# EAGLE design leduino (EAGLE 7.1.0)
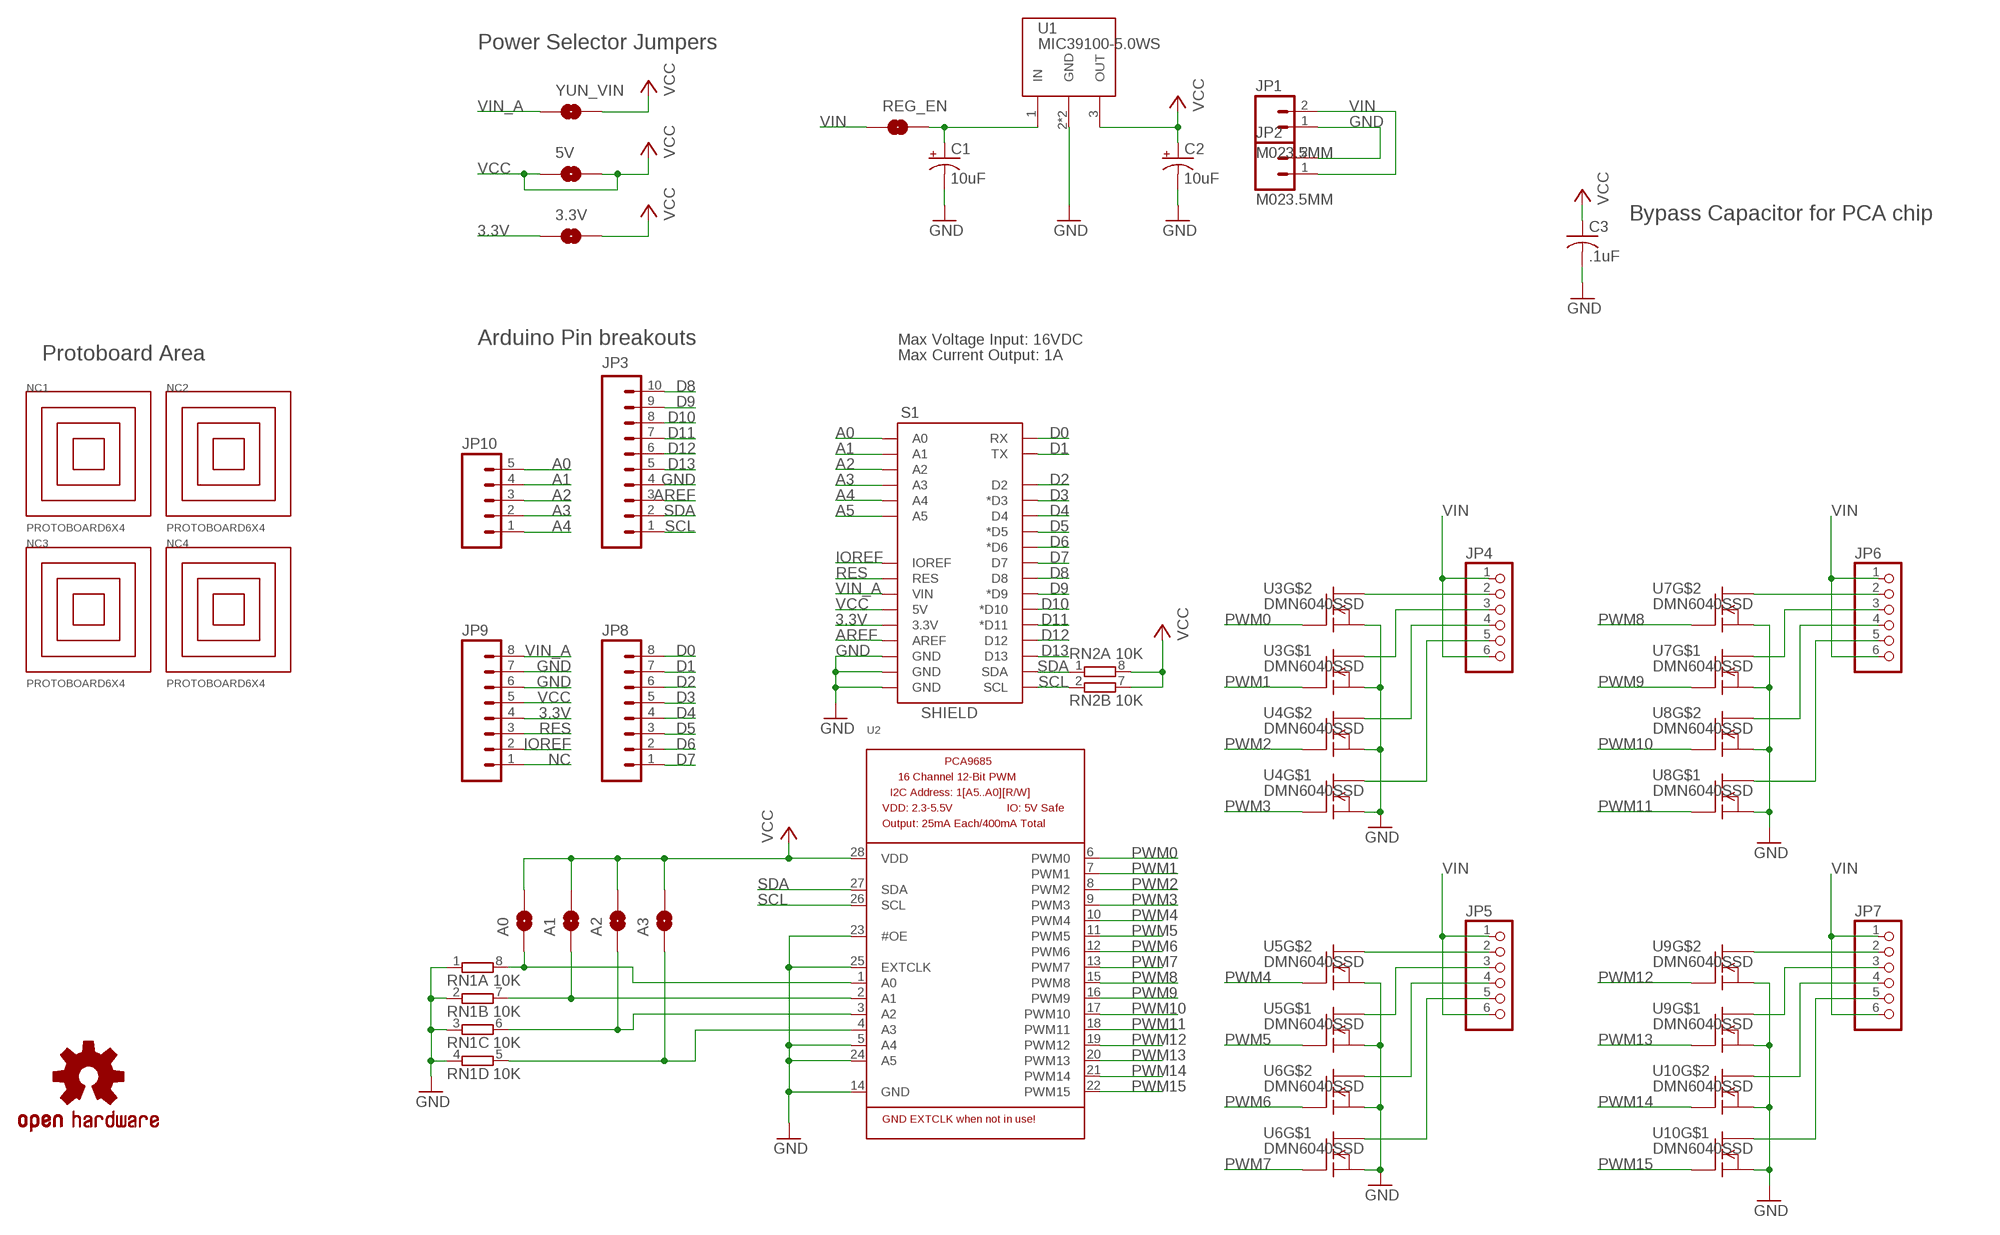
[diagram p0: schematic, sheet 1]

## Parts
3.3V  SOLDERJUMPERNO  [SJ_2S-NO]
5V  SOLDERJUMPERNO  [SJ_2S-NO]
A0  SOLDERJUMPERNO  [SJ_2S-NO]
A1  SOLDERJUMPERNO  [SJ_2S-NO]
A2  SOLDERJUMPERNO  [SJ_2S-NO]
A3  SOLDERJUMPERNO  [SJ_2S-NO]
C1  10uF  CAP_POL1206  [EIA3216]
C2  10uF  CAP_POL1206  [EIA3216]
C3  .1uF  C-USC0805  [C0805]
JP1  M023.5MM  [SCREWTERMINAL-3.5MM-2]
JP2  M023.5MM  [SCREWTERMINAL-3.5MM-2]
JP3  M10NO_SILK_PTH_FEMALE  [1X10_NO_SILK]
JP4  PINHD-1X63.5MM-RA  [1X06-3.5M-RA]
JP5  PINHD-1X63.5MM-RA  [1X06-3.5M-RA]
JP6  PINHD-1X63.5MM-RA  [1X06-3.5M-RA]
JP7  PINHD-1X63.5MM-RA  [1X06-3.5M-RA]
JP8  M08NO_SILK_FEMALE_PTH  [1X08_NO_SILK]
JP9  M08NO_SILK_FEMALE_PTH  [1X08_NO_SILK]
JP10  M05NO_SILK  [1X05_NO_SILK]
NC1  PROTOBOARD6X4  [PROTOBOARD_6X4]
NC2  PROTOBOARD6X4  [PROTOBOARD_6X4]
NC3  PROTOBOARD6X4  [PROTOBOARD_6X4]
NC4  PROTOBOARD6X4  [PROTOBOARD_6X4]
REG_EN  SOLDERJUMPERNO  [SJ_2S-NO]
RN1  10K  4R-NEXB38V  [EXB38V]
RN2  10K  4R-NEXB38V  [EXB38V]
S1  SHIELD  ARDUINO_R3_SHIELD  [ARDUINOR3]
U1  MIC39100-5.0WS  MIC39100  [SOT223]
U2  PCA9685  [TSSOP28]
U3  DMN6040SSD  [SO8]
U4  DMN6040SSD  [SO8]
U5  DMN6040SSD  [SO8]
U6  DMN6040SSD  [SO8]
U7  DMN6040SSD  [SO8]
U8  DMN6040SSD  [SO8]
U9  DMN6040SSD  [SO8]
U10  DMN6040SSD  [SO8]
U$6  OSHW-LOGOM  [OSHW-LOGO-M]
YUN_VIN  SOLDERJUMPERNO  [SJ_2S-NO]

## Nets
3.3V: 3.3V.1 JP9.4 S1.3V(3.3V)
A0: JP10.5 S1.A0
A1: JP10.4 S1.A1
A2: JP10.3 S1.A2
A3: JP10.2 S1.A3
A4: JP10.1 S1.A4
A5: S1.A5
AREF: JP3.3 S1.AREF
D0: JP8.8 S1.D0(RX)
D1: JP8.7 S1.D1(TX)
D2: JP8.6 S1.D2
D3: JP8.5 S1.D3(*D3)
D4: JP8.4 S1.D4
D5: JP8.3 S1.D5(*D5)
D6: JP8.2 S1.D6(*D6)
D7: JP8.1 S1.D7
D8: JP3.10 S1.D8
D9: JP3.9 S1.D9(*D9)
D10: JP3.8 S1.D10(*D10)
D11: JP3.7 S1.D11(*D11)
D12: JP3.6 S1.D12
D13: JP3.5 S1.D13
GND: C1.C(-) C2.C(-) C3.2 JP1.1 JP2.2 JP3.4 JP9.6 JP9.7 RN1.1 RN1.2 RN1.3 RN1.4 S1.GND S1.GND1(GND) S1.GND2(GND) U1.2(GND) U1.4(GND) U2.5(A4) U2.14(GND) U2.23(#OE) U2.24(A5) U2.25(EXTCLK) U3.1(S) U3.3(S) U4.1(S) U4.3(S) U5.1(S) U5.3(S) U6.1(S) U6.3(S) U7.1(S) U7.3(S) U8.1(S) U8.3(S) U9.1(S) U9.3(S) U10.1(S) U10.3(S)
IOREF: JP9.2 S1.IOREF
N$1: JP4.2 U3.5(D) U3.6(D)
N$2: JP4.3 U3.7(D) U3.8(D)
N$3: JP4.5 U4.7(D) U4.8(D)
N$4: JP4.4 U4.5(D) U4.6(D)
N$5: JP7.2 U9.5(D) U9.6(D)
N$6: JP7.3 U9.7(D) U9.8(D)
N$7: JP7.5 U10.7(D) U10.8(D)
N$8: JP7.4 U10.5(D) U10.6(D)
N$9: JP5.2 U5.5(D) U5.6(D)
N$10: JP5.3 U5.7(D) U5.8(D)
N$11: JP5.5 U6.7(D) U6.8(D)
N$12: JP5.4 U6.5(D) U6.6(D)
N$13: C1.A(+) REG_EN.2 U1.1(IN)
N$14: A3.1 RN1.5 U2.4(A3)
N$15: A0.1 RN1.8 U2.1(A0)
N$16: A1.1 RN1.7 U2.2(A1)
N$17: JP6.2 U7.5(D) U7.6(D)
N$18: JP6.3 U7.7(D) U7.8(D)
N$19: JP6.5 U8.7(D) U8.8(D)
N$20: JP6.4 U8.5(D) U8.6(D)
N$21: A2.1 RN1.6 U2.3(A2)
NC: JP9.1
PWM0: U2.6(PWM0) U3.4(G)
PWM1: U2.7(PWM1) U3.2(G)
PWM2: U2.8(PWM2) U4.4(G)
PWM3: U2.9(PWM3) U4.2(G)
PWM4: U2.10(PWM4) U5.4(G)
PWM5: U2.11(PWM5) U5.2(G)
PWM6: U2.12(PWM6) U6.4(G)
PWM7: U2.13(PWM7) U6.2(G)
PWM8: U2.15(PWM8) U7.4(G)
PWM9: U2.16(PWM9) U7.2(G)
PWM10: U2.17(PWM10) U8.4(G)
PWM11: U2.18(PWM11) U8.2(G)
PWM12: U2.19(PWM12) U9.4(G)
PWM13: U2.20(PWM13) U9.2(G)
PWM14: U2.21(PWM14) U10.4(G)
PWM15: U2.22(PWM15) U10.2(G)
RES: JP9.3 S1.RESET(RES)
SCL: JP3.1 RN2.2 S1.SCL U2.26(SCL)
SDA: JP3.2 RN2.1 S1.SDA U2.27(SDA)
VCC: 3.3V.2 5V.1 5V.2 A0.2 A1.2 A2.2 A3.2 C2.A(+) C3.1 JP9.5 RN2.7 RN2.8 S1.5V U1.3(OUT) U2.28(VDD) YUN_VIN.2
VIN: JP1.2 JP2.1 JP4.1 JP4.6 JP5.1 JP5.6 JP6.1 JP6.6 JP7.1 JP7.6 REG_EN.1
VIN_A: JP9.8 S1.VIN YUN_VIN.1
Unconnected: RN2.3 RN2.4 RN2.5 RN2.6

## Notes on the sheet
- Power Selector Jumpers
- Bypass Capacitor for PCA chip
- Arduino Pin breakouts | Max Voltage Input: 16VDC
- Protoboard Area | Max Current Output: 1A

## Library data of the parts
3.3V 5V A0 A1-A3 REG_EN YUN_VIN = Leduino:SOLDERJUMPER: Solder Jumper Standard SMD solder jumper. Used to automate production. Two varients : Normally Open and Normally Closed are the same, but have different paste layers. NC will have a large amount of paste and should jumper during reflow.
C1 C2 = SparkFun:CAP_POL: Capacitor Polarized These are standard SMD and PTH capacitors. Normally 10uF, 47uF, and 100uF in electrolytic and tantalum varieties. Always verify the external diameter of the through hole cap, it varies with capacity, voltage, and manufacturer. The EIA devices should be standard.
C3 = rcl:C-US: CAPACITOR, American symbol
JP1 JP2 = SparkFun-Connectors:M02: Standard 2-pin 0.1" header. Use with - straight break away headers ( PRT-00116) - right angle break away headers (PRT-00553) - swiss pins (PRT-00743) - machine pins (PRT-00117) - female headers (PRT-00115) Molex polarized connector foot print use with: PRT-08233 with associated crimp pins and housings. 2.54_SCREWTERM for use with PRT-10571. 3.5mm Screw Terminal footprints for PRT-08084 5mm Screw Terminal footprints for use with PRT-08432
JP3 = SparkFun-Connectors:M10: Header 10 Standard 10-pin 0.1" header. Use with straight break away headers (SKU : PRT-00116), right angle break away headers (PRT-00553), swiss pins (PRT-00743), machine pins (PRT-00117), and female headers (PRT-00115).; PROD_ID: CONN-11563
JP4-JP7 = Leduino:PINHD-1X6: PIN HEADER
JP8 JP9 = SparkFun-Connectors:M08: Header 8 Standard 8-pin 0.1" header. Use with straight break away headers (SKU : PRT-00116), right angle break away headers (PRT-00553), swiss pins (PRT-00743), machine pins (PRT-00117), and female headers (PRT-00115).; PROD_ID: CONN-08438
JP10 = SparkFun-Connectors:M05: Header 5 Standard 5-pin 0.1" header. Use with straight break away headers (SKU : PRT-00116), right angle break away headers (PRT-00553), swiss pins (PRT-00743), machine pins (PRT-00117), and female headers (PRT-00115). Molex polarized connector foot print use with SKU : PRT-08230 with associated crimp pins and housings.
NC1-NC4 = Leduino:PROTOBOARD
RN1 RN2 = resistor-dil:4R-N: Array Chip Resistor Source: RS Component / Phycomp; OC_FARNELL: unknown; OC_NEWARK: unknown
S1 = Leduino:ARDUINO_R3_SHIELD: Shield form compatible with the Arduino Uno R3.
U1 = Leduino:MIC39100
U2 = Leduino:PCA9685: PCA9685 - 16 Channel 12-Bit I2C PWM Controller 5.0V tolerant 16 channel, 12-bit I2C PWM controller with 25mA per output (max. 400mA total) Digikey: 568-5931-1-ND
U3-U10 = Leduino:DMN6040SSD
U$6 = Pro_Micro:OSHW-LOGO: Open Source Hardware Logo This logo indicates the piece of hardware it is found on incorporates a OSHW license and/or adheres to the definition of open source hardware found here: http://freedomdefined.org/OSHW

## Net classes
0 default: clearance 0.205 mm

## Board
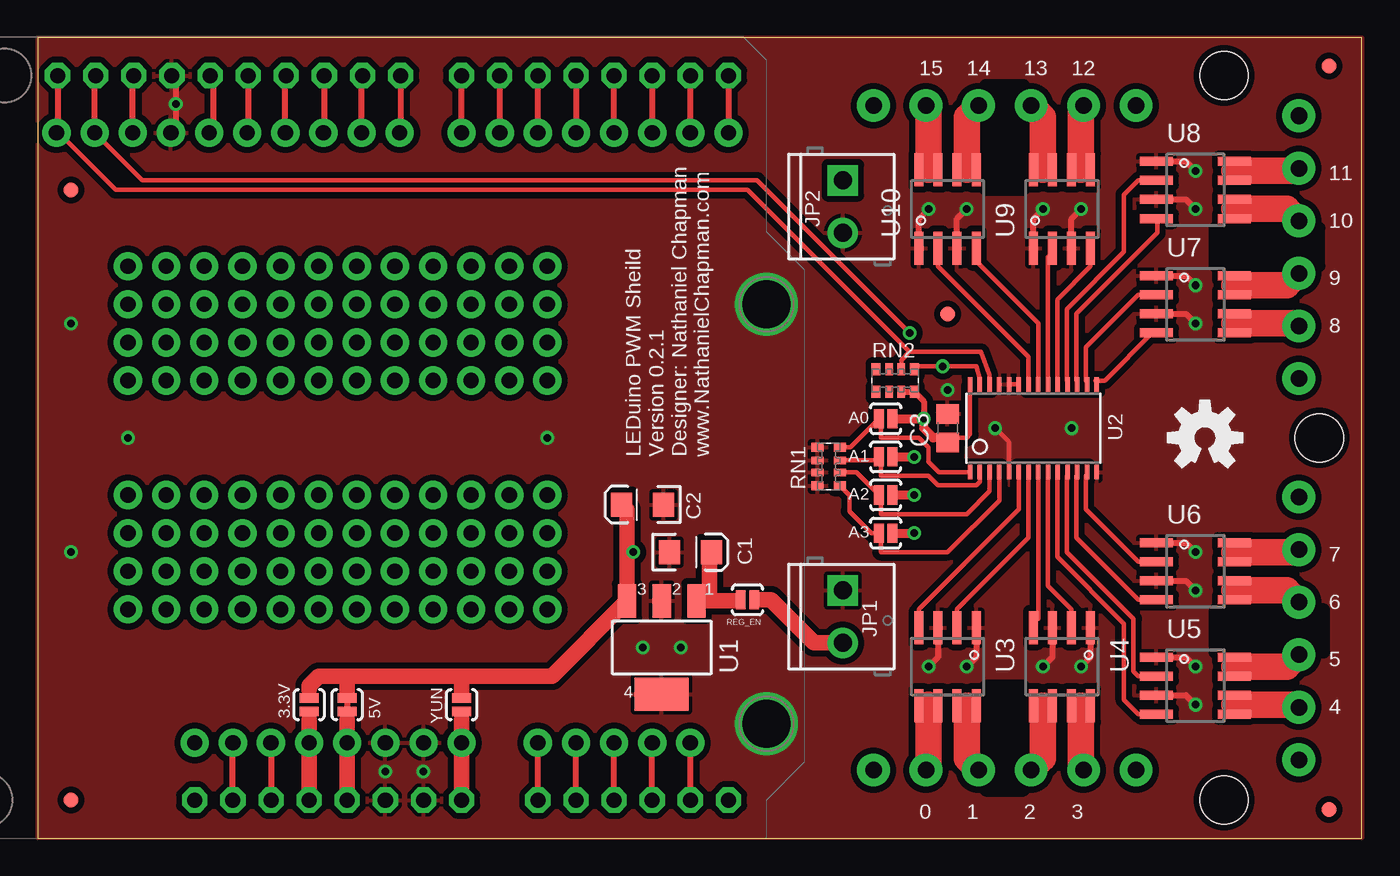
[diagram p1: board, top side]
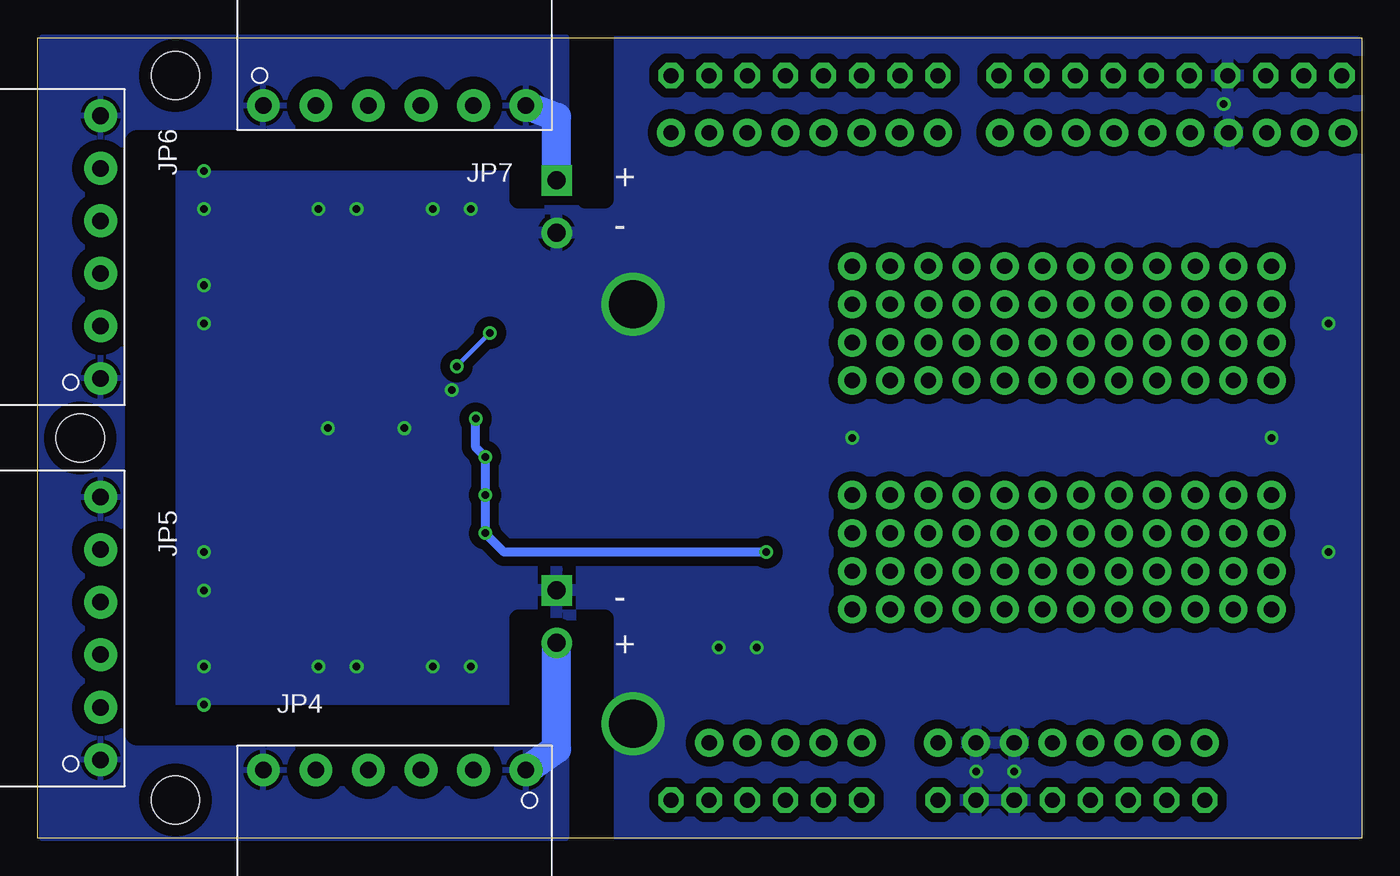
[diagram p2: board, bottom side, seen from below]

Size 88.25 x 53.33 mm. Coordinates in mm from the lower left corner, seen from the top.
Outline: 0,0 88.25,0 88.25,53.33 0,53.33 0,0
Copper layers (1*16): Top 0.0356mm / dielectric 63mil / Bottom 0.0356mm
Design rules "advanced": minimum track width 6mil, minimum drill 15mil, track to track 6mil, track to pad 6mil, pad to pad 6mil, via to via 6mil, smd to smd 6mil, copper to edge 0mil, drill to drill 6mil, minimum pad ring 10mil, minimum via ring 8mil, stop-mask expansion 4mil, vias tented up to drill 0mil, thermal gap 10mil
Holes 3.2 mm at 79.06,2.54 79.06,50.8 85.41,26.67
tRestrict: area 63.2,3.2 to 65.7,10.2; area 78.4,12.4 to 85.7,15.2; area 78.4,38.1 to 85.4,40.6; area 63.2,43.2 to 65.7,50.2
bRestrict: area 54.9,45.1 to 81.6,46.4; area 54.9,7 to 81.6,8.3; area 79.7,8.3 to 81.6,45.1; area 50.5,42.5 to 51.8,53.3; area 50.5,0 to 51.8,14.6; area 54.9,8.9 to 56.2,14.6; area 54.9,42.5 to 56.2,45.1

### Footprints (pad centres in the part's own frame; a part is rotated, then mirrored left to right if it is on the bottom)
SJ_2S-NO = smd 0.635 x 1.27: 1 -0.45,0; 2 0.45,0
EIA3216 = smd 1.4 x 1.6: A 1.4,0; C -1.4,0
C0805 = smd 1.3 x 1.5: 1 -0.95,0; 2 0.95,0
SCREWTERMINAL-3.5MM-2 = drill 1.2 pad 2.032 square: 1 0,0 | drill 1.2 pad 2.032: 2 3.5,0
1X10_NO_SILK = drill 1.016 pad 1.88: 1 0,0; 2 2.54,0; 3 5.08,0; 4 7.62,0; 5 10.16,0; 6 12.7,0; 7 15.24,0; 8 17.78,0; 9 20.32,0; 10 22.86,0
1X06-3.5M-RA = drill 1.1 pad 2.184: 1 -8.75,-2; 2 -5.25,-2; 3 -1.75,-2; 4 1.75,-2; 5 5.25,-2; 6 8.75,-2
1X08_NO_SILK = drill 1.016 pad 1.88: 1 0,0; 2 2.54,0; 3 5.08,0; 4 7.62,0; 5 10.16,0; 6 12.7,0; 7 15.24,0; 8 17.78,0
1X05_NO_SILK = drill 1.016 pad 1.88: 1 0,0; 2 2.54,0; 3 5.08,0; 4 7.62,0; 5 10.16,0
PROTOBOARD_6X4 = drill 1.016 pad 1.88: 1 0,3.81; 2 2.54,3.81; 3 5.08,3.81; 4 7.62,3.81; 5 10.16,3.81; 6 12.7,3.81; 7 0,1.27; 8 2.54,1.27; 9 5.08,1.27; 10 7.62,1.27; 11 10.16,1.27; 12 12.7,1.27; 13 0,-1.27; 14 2.54,-1.27; 15 5.08,-1.27; 16 7.62,-1.27; 17 10.16,-1.27; 18 12.7,-1.27; 19 0,-3.81; 20 2.54,-3.81; 21 5.08,-3.81; 22 7.62,-3.81; 23 10.16,-3.81; 24 12.7,-3.81
EXB38V = smd 0.6 x 0.8: 1 -1.275,-0.75; 4 1.275,-0.75; 5 1.275,0.75; 8 -1.275,0.75 | smd 0.5 x 0.8: 2 -0.4,-0.75; 3 0.4,-0.75; 6 0.4,0.75; 7 -0.4,0.75
ARDUINOR3 = drill 1 pad 1.676 octagon: 3V 35.56,2.54; 5V 38.1,2.54; A0 50.8,2.54; A1 53.34,2.54; A2 55.88,2.54; A3 58.42,2.54; A4 60.96,2.54; A5 63.5,2.54; AREF 23.876,50.8; D0 63.5,50.8; D1 60.96,50.8; D2 58.42,50.8; D3 55.88,50.8; D4 53.34,50.8; D5 50.8,50.8; D6 48.26,50.8; D7 45.72,50.8; D8 41.656,50.8; D9 39.116,50.8; D10 36.576,50.8; D11 34.036,50.8; D12 31.496,50.8; D13 28.956,50.8; GND 26.416,50.8; GND1 43.18,2.54; GND2 40.64,2.54; IOREF 30.48,2.54; RESERVED 27.94,2.54; RESET 33.02,2.54; SCL 18.796,50.8; SDA 21.336,50.8; VIN 45.72,2.54
SOT223 = smd 1.219 x 2.235: 1 -2.311,-3.099; 2 0,-3.099; 3 2.311,-3.099 | smd 3.6 x 2.2: 4 0,3.099
TSSOP28 = smd 0.305 x 0.991: 1 -4.225,-2.918; 2 -3.575,-2.918; 3 -2.925,-2.918; 4 -2.275,-2.918; 5 -1.625,-2.918; 6 -0.975,-2.918; 7 -0.325,-2.918; 8 0.325,-2.918; 9 0.975,-2.918; 10 1.625,-2.918; 11 2.275,-2.918; 12 2.925,-2.918; 13 3.575,-2.918; 14 4.225,-2.918; 15 4.225,2.918; 16 3.575,2.918; 17 2.925,2.918; 18 2.275,2.918; 19 1.625,2.918; 20 0.975,2.918; 21 0.325,2.918; 22 -0.325,2.918; 23 -0.975,2.918; 24 -1.625,2.918; 25 -2.275,2.918; 26 -2.925,2.918; 27 -3.575,2.918; 28 -4.225,2.918
SO8 = smd 0.6 x 2.2: 1 -1.905,-2.6; 2 -0.635,-2.6; 3 0.635,-2.6; 4 1.905,-2.6; 5 1.905,2.6; 6 0.635,2.6; 7 -0.635,2.6; 8 -1.905,2.6
FIDUCIAL-1X2 = smd 1 x 1: 1 0,0

### Placement (x,y rotation side)
3.3V  18.1,8.89 90 top
5V  20.64,8.89 90 top
A0  56.52,27.94 0 top
A1  56.52,25.4 0 top
A2  56.52,22.86 0 top
A3  56.52,20.32 0 top
C1  43.5,19.05 0 top
C2  40.32,22.23 180 top
C3  60.64,27.3 90 top
JP1  53.66,16.51 270 top
JP2  53.66,43.81 270 top
JP3  1.27,46.99 0 top
JP4  64.45,2.54 180 bottom
JP5  86.04,13.97 90 bottom
JP6  86.04,39.37 90 bottom
JP7  64.45,50.8 0 bottom
JP8  28.26,46.99 0 top
JP9  10.48,6.35 0 top
JP10  43.5,6.35 180 top
NC1  6.03,34.29 0 top
NC2  6.03,19.05 0 top
NC3  21.27,34.29 0 top
NC4  21.27,19.05 0 top
REG_EN  47.31,15.88 180 top
RN1  52.7,24.77 270 top
RN2  57.15,30.48 180 top
S1  -17.46,0 0 top
U1  41.59,12.7 180 top
U2  66.36,27.3 0 top
U3  60.64,11.43 180 top
U4  68.26,11.43 180 top
U5  77.15,10.16 270 top
U6  77.15,17.78 270 top
U7  77.15,35.56 270 top
U8  77.15,43.18 270 top
U9  68.26,41.91 0 top
U10  60.64,41.91 0 top
U$1  [FIDUCIAL-1X2]  2.22,2.54 0 top
U$2  [FIDUCIAL-1X2]  86.04,1.91 0 top
U$3  [FIDUCIAL-1X2]  60.64,34.92 0 top
U$4  [FIDUCIAL-1X2]  2.22,43.18 0 top
U$5  [FIDUCIAL-1X2]  86.04,51.44 0 top
U$6  77.79,26.67 0 top
YUN_VIN  28.26,8.89 90 top

### Tracks (layer width: path | path; a pad name or v marks a point on that pad's centre or on a via)
3.3V
  Top 0.254: 18.1,7.94 3.3V.1
  Top 1.016: S1.3V JP9.4 18.1,7.94
A0
  Top 0.406: S1.A0 JP10.5
A1
  Top 0.406: S1.A1 JP10.4
A2
  Top 0.406: S1.A2 JP10.3
A3
  Top 0.406: S1.A3 JP10.2
A4
  Top 0.406: S1.A4 JP10.1
AREF
  Top 0.406: JP3.3 6.35,50.74 S1.AREF
D0
  Top 0.406: S1.D0 JP8.8
D1
  Top 0.406: JP8.7 S1.D1
D2
  Top 0.406: S1.D2 JP8.6
D3
  Top 0.406: JP8.5 S1.D3
D4
  Top 0.406: S1.D4 JP8.4
D5
  Top 0.406: JP8.3 S1.D5
D6
  Top 0.406: S1.D6 JP8.2
D7
  Top 0.406: JP8.1 S1.D7
D8
  Top 0.406: S1.D8 24.19,47.05 JP3.10
D9
  Top 0.406: JP3.9 21.59,50.74 S1.D9
D10
  Top 0.406: S1.D10 19.11,47.05 JP3.8
D11
  Top 0.406: JP3.7 16.51,50.74 S1.D11
D12
  Top 0.406: S1.D12 14.03,47.05 JP3.6
D13
  Top 0.406: JP3.5 11.75,46.99 11.75,50.55 S1.D13
GND  (via drill 0.5, 3.2)
  Top 0.305: U2.23 U2.24 | U2.5 64.73,26.39 v63.82,27.3
  Top 0.406: U10.1 58.74,41.27 v59.37,41.91 | U10.3 61.28,41.27 v61.91,41.91 | U9.1 66.36,41.27 v66.99,41.91 | U9.3 68.9,41.27 v69.53,41.91 | U8.1 76.52,45.09 v77.15,44.45 | U8.3 76.52,42.55 v77.15,41.91 | U7.1 76.52,37.47 v77.15,36.83 | U7.3 76.52,34.92 v77.15,34.29 | U6.1 76.52,19.68 v77.15,19.05 | U6.3 76.52,17.14 v77.15,16.51 | U5.1 76.52,12.06 v77.15,11.43 | U5.3 76.52,9.53 v77.15,8.89 | U4.1 70.17,12.06 v69.53,11.43 | U4.3 67.63,12.06 v66.99,11.43 | U3.1 62.55,12.06 v61.91,11.43 | U3.3 60.01,12.06 v59.37,11.43 | S1.GND 9.21,50.8 9.21,47.31 JP3.4
  other vias: 48.58,35.56 48.58,7.62 68.9,27.3 23.18,4.45 25.72,4.45 40.32,12.7 42.86,12.7 60.64,29.84 9.21,48.9 33.97,26.67 6.03,26.67 2.22,34.29 2.22,19.05
  pour Top (isolate 0.406): 0,53.34 88.27,53.34 88.27,0 0,0
  pour Bottom (isolate 0.61, rank 2): 0.32,53.02 87.95,53.02 87.95,0.32 0.32,0.32
IOREF
  Top 0.406: S1.IOREF JP9.2
N$1
  Top 0.406: U3.6 60.01,8.89 59.37,8.89 58.8,8.89 U3.5
  Top 1.778: JP4.2 59.37,4.71 59.37,8.89
N$2
  Top 0.406: U3.8 61.91,8.83 U3.7
  Top 1.778: JP4.3 61.91,5.33 61.91,8.83
N$3
  Top 0.406: U4.8 69.53,8.83 U4.7
  Top 1.778: JP4.5 69.53,4.71 69.53,8.83
N$4
  Top 0.406: U4.6 66.99,8.83 U4.5
  Top 1.778: JP4.4 66.99,5.33 66.99,8.83
N$5
  Top 0.406: U9.6 69.53,44.51 U9.5
  Top 1.778: JP7.2 69.53,48.63 69.53,44.51
N$6
  Top 0.406: U9.8 66.99,44.51 U9.7
  Top 1.778: JP7.3 66.99,48.01 66.99,44.51
N$7
  Top 0.406: U10.7 59.37,44.51 U10.8
  Top 1.778: JP7.5 59.37,48.63 59.37,44.51
N$8
  Top 0.406: U10.6 61.91,44.51 U10.5
  Top 1.778: JP7.4 61.91,48.01 61.91,44.51
N$9
  Top 0.406: U5.5 79.75,8.89 U5.6
  Top 1.778: JP5.2 83.87,8.89 79.75,8.89
N$10
  Top 0.406: U5.7 79.75,11.43 U5.8
  Top 1.778: JP5.3 83.25,11.43 79.75,11.43
N$11
  Top 0.406: U6.7 79.75,19.05 U6.8
  Top 1.778: JP5.5 83.87,19.05 79.75,19.05
N$12
  Top 0.406: U6.6 79.75,16.51 U6.5
  Top 1.778: JP5.4 83.25,16.51 79.75,16.51
N$13
  Top 0.254: 46.67,15.88 REG_EN.2
  Top 0.813: 46.67,15.8 46.67,15.88
  Top 1.016: U1.1 44.77,15.8 | 44.77,15.8 46.67,15.8 | C1.A 44.77,18.92 44.77,15.8
N$14
  Top 0.305: U2.4 64.08,22.49 60.64,19.05 56.2,19.05 56.2,20.32 A3.1 55.56,20.32 54.09,21.79 54.09,22.86 RN1.5
N$15
  Top 0.305: U2.1 60.07,24.39 59.37,25.08 59.37,26.04 58.74,26.67 56.2,26.67 56.2,27.81 A0.1 | 55.99,27.94 A0.1 | RN1.8 54.17,26.04 A0.1
N$16
  Top 0.305: U2.2 62.78,23.73 62.55,23.5 60.01,23.5 59.37,24.13 56.2,24.13 56.2,25.27 A1.1 55.83,25.16 RN1.7
N$17
  Top 0.406: U7.5 79.75,34.29 U7.6
  Top 1.778: JP6.2 83.87,34.29 79.75,34.29
N$18
  Top 0.406: U7.8 79.75,36.83 U7.7
  Top 1.778: JP6.3 83.25,36.83 79.75,36.83
N$19
  Top 0.406: U8.8 79.75,44.45 U8.7
  Top 1.778: JP6.5 83.87,44.45 79.75,44.45
N$20
  Top 0.406: U8.6 79.75,41.91 U8.5
  Top 1.778: JP6.4 83.25,41.91 79.75,41.91
N$21
  Top 0.305: U2.3 63.43,23.11 61.91,21.59 56.2,21.59 56.2,22.73 A2.1 54.56,24.36 RN1.6
PWM0
  Top 0.152: 65.4,24.13 U2.6
  Top 0.305: 65.4,24.13 65.4,21.91 58.74,15.24 U3.4
PWM1
  Top 0.152: 66.04,24.13 U2.7
  Top 0.305: 66.04,24.13 66.04,20 61.28,15.24 U3.2
PWM2
  Top 0.152: 66.68,14.61 66.36,14.29 U4.4 | 66.68,24.13 U2.8
  Top 0.305: 66.68,14.61 66.68,24.13
PWM3
  Top 0.152: 67.31,24.13 U2.9
  Top 0.305: 67.31,24.13 67.31,16.83 68.9,15.24 U4.2
PWM4
  Top 0.152: 67.95,24.13 U2.10
  Top 0.305: 67.95,24.13 67.95,18.73 72.39,14.29 72.39,9.21 73.34,8.26 U5.4
PWM5
  Top 0.152: 68.58,24.13 U2.11
  Top 0.305: 68.58,24.13 68.58,19.05 73.03,14.61 73.03,11.11 73.34,10.79 U5.2
PWM6
  Top 0.152: 69.21,24.13 U2.12
  Top 0.305: 69.21,24.13 69.21,20 73.34,15.88 U6.4
PWM7
  Top 0.152: 69.85,24.13 U2.13
  Top 0.305: 69.85,24.13 69.85,21.91 73.34,18.41 U6.2
PWM8
  Top 0.152: 70.48,30.48 U2.15 | 74.29,33.66 U7.4
  Top 0.305: 70.48,30.48 71.12,30.48 74.29,33.66
PWM9
  Top 0.152: 69.85,30.48 U2.16
  Top 0.305: 69.85,30.48 69.85,32.7 73.34,36.2 U7.2
PWM10
  Top 0.152: 69.21,30.48 U2.17
  Top 0.305: 69.21,30.48 69.21,34.92 74.61,40.32 74.61,41.22 U8.4
PWM11
  Top 0.152: 68.58,30.48 U2.18
  Top 0.305: 68.58,30.48 68.58,35.24 72.39,39.05 72.39,42.86 73.34,43.81 U8.2
PWM12
  Top 0.152: 67.95,30.48 U2.19
  Top 0.305: 67.95,30.48 67.95,35.88 70.17,38.1 U9.4
PWM13
  Top 0.152: 67.31,38.73 67.63,39.05 U9.2 | 67.31,30.48 U2.20
  Top 0.305: 67.31,38.73 67.31,30.48
PWM14
  Top 0.152: 66.68,30.48 U2.21
  Top 0.305: 66.68,30.48 66.68,34.29 62.55,38.42 U10.4
PWM15
  Top 0.152: 66.04,30.48 U2.22
  Top 0.305: 66.04,30.48 66.04,32.07 60.01,38.1 U10.2
RES
  Top 0.406: JP9.3 S1.RESET
SCL
  Top 0.305: 1.33,47.05 5.21,43.18 47.31,43.18 58.1,32.38 | 58.1,32.38 62.86,32.38 63.43,30.86 U2.26 | 58.1,32.38 57.55,31.83 RN2.2
  Top 0.406: S1.SCL 1.33,47.05 JP3.1
SDA  (via drill 0.5)
  Top 0.305: JP3.2 6.99,43.81 47.94,43.81 v58.1,33.66 | RN2.1 58.63,31.43 v60.32,31.43 62.55,31.43 62.78,30.56 U2.27
  Top 0.406: JP3.2 3.81,50.74 S1.SDA
  Bottom 0.305: v58.1,33.66 v60.32,31.43
VCC  (via drill 0.5)
  Top 0.254: 18.1,9.84 3.3V.2 | 5V.2 20.64,9.53 | 20.64,7.94 5V.1
  Top 0.305: C3.1 60.33,26.67 61.91,26.67 62.13,26.89 U2.28 | YUN_VIN.2 28.26,9.53 | 5V.1 20.64,8.26
  Top 0.406: RN2.7 RN2.8 59.06,29.09 v59.06,27.94 | 5V.2 5V.1
  Top 0.61: A1.2 v58.42,25.4 | A0.2 v59.06,27.94 59.06,27.3 59.69,26.67 60.33,26.67 | A2.2 v58.42,22.86 | v39.69,19.05 39.28,19.05 | A3.2 v58.42,20.32
  Top 1.016: C2.A 39.28,21.87 39.28,19.05 U1.3 34.28,10.79 28.26,10.79 | 28.26,10.79 20.64,10.79 | 20.64,10.79 18.73,10.79 18.1,10.16 18.1,9.84 | 28.26,9.53 28.26,10.79 | 20.64,9.53 20.64,10.79 | S1.5V JP9.5 20.64,7.94
  Bottom 0.61: v39.69,19.05 57.15,19.05 v58.42,20.32 v58.42,22.86 v58.42,25.4 59.06,26.04 v59.06,27.94
VIN
  Top 0.254: 47.94,15.88 REG_EN.1
  Top 1.016: 47.94,15.88 48.89,15.88 51.75,13.01 JP1.2
  Bottom 1.93: JP1.2 53.66,5.95 JP4.1 | JP2.1 53.66,48.02 JP7.6
  pour Bottom (isolate 0.813): 53.02,6.35 53.02,0 87.95,0 87.95,53.34 53.02,53.34 53.02,46.99 82.23,46.99 82.23,6.35
VIN_A
  Top 0.254: YUN_VIN.1 28.26,7.94
  Top 1.016: S1.VIN JP9.8 28.26,7.94

### Text on the board
tNames: 15 | 14 | 13 | 12 | 11 | 10 | 9 | 8 | LEDuino PWM Sheild / Version 0.2.1 / Designer: Nathaniel Chapman / www.NathanielChapman.com | 7 | 6 | 5 | YUN | 4 | 0 | 1 | 2 | 3
bNames: + | - | - | +